# Altium project WT-METER-2CH.PrjPcb (part 1 of 2)
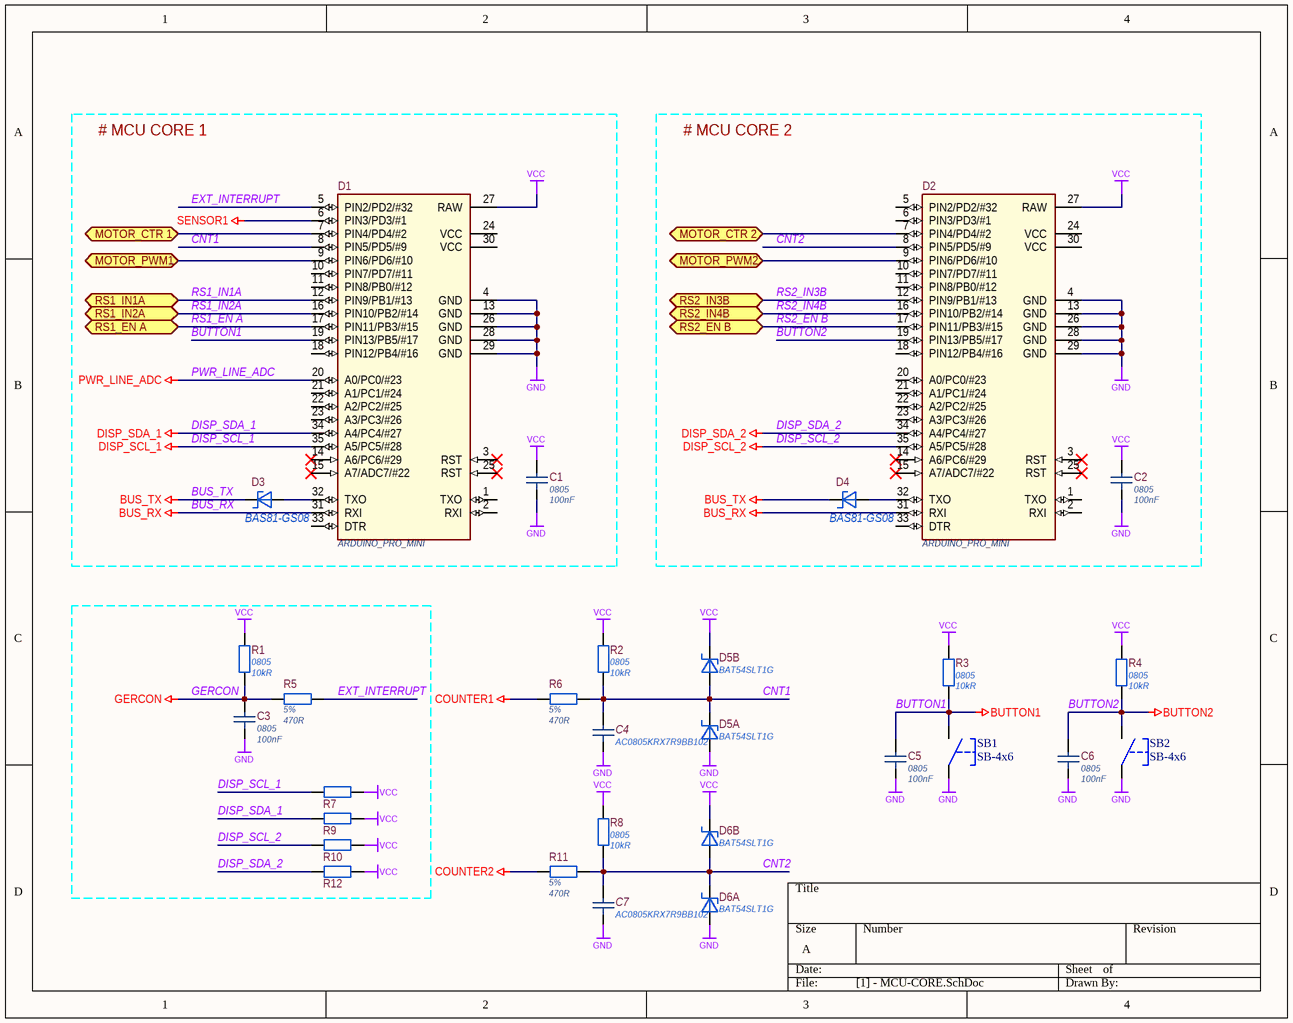
[diagram p0: [1] - MCU-CORE.SchDoc]
7 sheets, 109 parts. Net scope: flat (ports and power ports of the same name join across sheets).
Board file: WT-METER-V0R0B0.PcbDoc
Sheets:
  [1] - MCU-CORE.SchDoc
  [3] - MOTOR-CONTROL.SchDoc
  [4] - MOTOR-DRIVER.SchDoc
  [5] - RS485-TRANSCEIVER.SchDoc
  [6] - POWER.SchDoc
  [7] - CONNECTORS.SchDoc
  [8] - SENSORLESS.SchDoc

## Sheet [1] - MCU-CORE.SchDoc
size A

### Parts
C1  Case/Package: 0805  Capacitance: 100nF  [CH0805C]  (hidden comment: AC0805KRX7R9BB104)
C2  Case/Package: 0805  Capacitance: 100nF  [CH0805C]  (hidden comment: AC0805KRX7R9BB104)
C3  Case/Package: 0805  Capacitance: 100nF  [CH0805C]  (hidden comment: AC0805KRX7R9BB104)
C4  AC0805KRX7R9BB102  [CH0805C]
C5  Case/Package: 0805  Capacitance: 100nF  [CH0805C]  (hidden comment: AC0805KRX7R9BB104)
C6  Case/Package: 0805  Capacitance: 100nF  [CH0805C]  (hidden comment: AC0805KRX7R9BB104)
C7  AC0805KRX7R9BB102  [CH0805C]
D1  ARDUINO_PRO_MINI  [DEV-11114]
D2  ARDUINO_PRO_MINI  [DEV-11114]
D3  BAS81-GS08  [SOD-80]
D4  BAS81-GS08  [SOD-80]
D5  BAT54SLT1G  [SOT23-3]  (parts A,B of 2)
D6  BAT54SLT1G  [SOT23-3]  (parts A,B of 2)
R1  Case/Package: 0805  Resistance: 10kR  [CH0805R]  (hidden comment: RC0805JR-0710KL)
R2  Case/Package: 0805  Resistance: 10kR  [CH0805R]  (hidden comment: RC0805JR-0710KL)
R3  Case/Package: 0805  Resistance: 10kR  [CH0805R]  (hidden comment: RC0805JR-0710KL)
R4  Case/Package: 0805  Resistance: 10kR  [CH0805R]  (hidden comment: RC0805JR-0710KL)
R5  Tolerance: 5%  Resistance: 470R  [CH0805R]  (hidden comment: RC0805JR-07470RL)
R6  Tolerance: 5%  Resistance: 470R  [CH0805R]  (hidden comment: RC0805JR-07470RL)
R7  RC0805JR-074K7L  [CH0805R]  (value not drawn)
R8  Case/Package: 0805  Resistance: 10kR  [CH0805R]  (hidden comment: RC0805JR-0710KL)
R9  RC0805JR-074K7L  [CH0805R]  (value not drawn)
R10  RC0805JR-074K7L  [CH0805R]  (value not drawn)
R11  Tolerance: 5%  Resistance: 470R  [CH0805R]  (hidden comment: RC0805JR-07470RL)
R12  RC0805JR-074K7L  [CH0805R]  (value not drawn)
SB1  SB-4x6  [Button-6*4.5]
SB2  SB-4x6  [Button-6*4.5]

### Blocks framed on the sheet
# MCU CORE 1: C1 D1 D3
# MCU CORE 2: C2 D2 D4

### Ports
MOTOR_CTR 1 (bidir), MOTOR_CTR 2 (bidir), MOTOR_PWM1 (bidir), MOTOR_PWM2 (bidir), RS1_EN A (bidir), RS1_IN1A (bidir), RS1_IN2A (bidir), RS2_EN B (bidir), RS2_IN3B (bidir), RS2_IN4B (bidir)

### Nets
BUS_RX: D1.31(RXI) D2.31(RXI)
BUS_TX: D3.2(K) D4.2(K)
BUTTON1: C5.1 D1.19(PIN13/PB5/#17) R3.1 SB1.2
BUTTON2: C6.1 D2.19(PIN13/PB5/#17) R4.1 SB2.2
COUNTER1: R6.1
COUNTER2: R11.1
DISP_SCL_1: D1.35(A5/PC5/#28) R7.2
DISP_SCL_2: D2.35(A5/PC5/#28) R10.2
DISP_SDA_1: D1.34(A4/PC4/#27) R9.2
DISP_SDA_2: D2.34(A4/PC4/#27) R12.2
GERCON: C3.1 R1.1 R5.1
GND: C1.2 C2.2 C3.2 C4.2 C5.2 C6.2 C7.2 D1.4(GND) D1.13(GND) D1.26(GND) D1.28(GND) D1.29(GND) D2.4(GND) D2.13(GND) D2.26(GND) D2.28(GND) D2.29(GND) D5.1 D6.1 SB1.1 SB2.1
PWR_LINE_ADC: D1.20(A0/PC0/#23)
SENSOR1: D1.6(PIN3/PD3/#1)
VCC: C1.1 C2.1 D1.27(RAW) D2.27(RAW) D5.2 D6.2 R1.2 R2.2 R3.2 R4.2 R7.1 R8.2 R9.1 R10.1 R12.1
CNT1: C4.1 D1.8(PIN5/PD5/#9) D5.3 R2.1 R6.2
CNT2: C7.1 D2.8(PIN5/PD5/#9) D6.3 R8.1 R11.2
EXT_INTERRUPT: D1.5(PIN2/PD2/#32) R5.2
RS1_EN A: D1.17(PIN11/PB3/#15) ; port RS1_EN A
RS1_IN1A: D1.12(PIN9/PB1/#13) ; port RS1_IN1A
RS1_IN2A: D1.16(PIN10/PB2/#14) ; port RS1_IN2A
RS2_EN B: D2.17(PIN11/PB3/#15) ; port RS2_EN B
RS2_IN3B: D2.12(PIN9/PB1/#13) ; port RS2_IN3B
RS2_IN4B: D2.16(PIN10/PB2/#14) ; port RS2_IN4B
NetD1_7: D1.7(PIN4/PD4/#2) ; port MOTOR_CTR 1
NetD1_9: D1.9(PIN6/PD6/#10) ; port MOTOR_PWM1
NetD1_32: D1.32(TXO) D3.1(A)
NetD2_7: D2.7(PIN4/PD4/#2) ; port MOTOR_CTR 2
NetD2_9: D2.9(PIN6/PD6/#10) ; port MOTOR_PWM2
NetD2_32: D2.32(TXO) D4.1(A)

Not connected (* = marked no-connect by the designer): D1 1(TXO) 2(RXI) 3(RST)* 10(PIN7/PD7/#11) 11(PIN8/PB0/#12) 14(A6/PC6/#29)* 15(A7/ADC7/#22)* 18(PIN12/PB4/#16) 21(A1/PC1/#24) 22(A2/PC2/#25) 23(A3/PC3/#26) 24(VCC) 25(RST)* 30(VCC) 33(DTR); D2 1(TXO) 2(RXI) 3(RST)* 5(PIN2/PD2/#32) 6(PIN3/PD3/#1) 10(PIN7/PD7/#11) 11(PIN8/PB0/#12) 14(A6/PC6/#29)* 15(A7/ADC7/#22)* 18(PIN12/PB4/#16) 20(A0/PC0/#23) 21(A1/PC1/#24) 22(A2/PC2/#25) 23(A3/PC3/#26) 24(VCC) 25(RST)* 30(VCC) 33(DTR)

### Library data of the parts
C1-C3 C5 C6 = AC0805KRX7R9BB104: 0.10µF 50V Ceramic Capacitor X7R 0805 (2012 Metric) 0.079" L x 0.049" W (2.00mm x 1.25mm); Manufacturer 1: Yageo; Tolerance: 10%; Supplier 1: Digi-Key; Manufacturer Part Number 1: AC0805KRX7R9BB104; Stock 1: 18765; Pricing 1: 1=0.23000, 10=0.15600, 100=0.07930, 500=0.05424, 1000=0.04799 (USD); RoHS: Yes; Mount: Surface Mount; Min Operating Temperature: -55°C; Max Operating Temperature: 125°C; Packaging: Tape and Reel; Voltage Rating: 50V; Length: 0.079inch; Width: 0.049inch; Thickness: 0.028inch; Ratings: AEC-Q200; Lead Free: Lead Free; ComponentLink1URL: http://www.yageo.com/documents/recent/UPY-AC_NP0X7R_16V-to-630V_12.pdf?src-supplier=Digi-Key; ComponentLink1Description: http://www.yageo.com/documents/recent/UPY-AC_NP0X7R_16V-to-630V_12.pdf?src-supplier=Digi-Key; Supplier Part Number 1: 311-3037-1-ND; Supplier 2: Digi-Key; Supplier Part Number 2: 311-1939-2-ND
C4 C7 = AC0805KRX7R9BB102: CAP CER 1000PF 50V X7R 0805; Manufacturer 1: Yageo; Supplier 1: Digi-Key; Manufacturer Part Number 1: AC0805KRX7R9BB102; Stock 1: 6153; Pricing 1: 1=0.21000, 10=0.14500, 100=0.07340, 500=0.05020, 1000=0.04440 (USD); RoHS: No; Lead Free: Lead Free; Supplier Part Number 1: 311-3173-1-ND
D1 D2 = ARDUINO_PRO_MINI: ATMEGA328 ARDUINO PRO MINI 3.3V; Manufacturer 1: SparkFun; Supplier 1: Digi-Key; Manufacturer Part Number 1: DEV-11114; Stock 1: 569; Pricing 1: 1=9.95000 (USD); RoHS: No; Supplier Part Number 1: 1568-1054-ND
D3 D4 = BAS81-GS08: Diode Small Signal Schottky 40V 0.03A 2-Pin Mini-MELF SOD-80 T/R; Manufacturer 1: Vishay Semiconductors; Max Surge Current: 500mA; Forward Voltage: 1V; Forward Current: 30mA; Peak Reverse Current: 200nA; Element Configuration: Single; Current Rating: 30A; Supplier 1: Digi-Key; Manufacturer Part Number 1: BAS81-GS08; Stock 1: 12175; Pricing 1: 1=0.37000, 10=0.29900, 100=0.15850, 500=0.10428, 1000=0.07092 (USD); RoHS: Yes; Mount: Surface Mount; Number of Pins: 2; Contact Plating: Tin,Silver; Min Operating Temperature: -65°C; Max Operating Temperature: 125°C; Packaging: Tape and Reel; Package Quantity: 2500; Average Rectified Current: 30mA; Max Reverse Leakage Current: 200nA; Peak Non-Repetitive Surge Current: 500mA; Max Repetitive Reverse Voltage (Vrrm): 40V; Max Reverse Voltage (DC): 40V; Max Forward Surge Current (Ifsm): 500mA; Diameter: 1.6mm; Length: 3.7mm; Height: 1.6mm; Width: 1.6mm; Radiation Hardening: No; REACH SVHC: Unknown; ComponentLink1URL: https://datasheet.ciiva.com/1240/1698309-1240528.pdf?src-supplier=Newark; ComponentLink1Description: https://datasheet.ciiva.com/1240/1698309-1240528.pdf?src-supplier=Newark; ComponentLink2URL: https://datasheet.ciiva.com/15144/getdatasheetpartid-45935-15144179.pdf?src-supplier=Verical; ComponentLink2Description: https://datasheet.ciiva.com/15144/getdatasheetpartid-45935-15144179.pdf?src-supplier=Verical; ComponentLink3URL: https://datasheet.ciiva.com/4245/bas81-4245446.pdf?src-supplier=Arrow; ComponentLink3Description: https://datasheet.ciiva.com/4245/bas81-4245446.pdf?src-supplier=Arrow; ComponentLink4URL: https://datasheet.ciiva.com/17076/bas81-gs08-17076266.pdf?src-supplier=Allied+Electronics; ComponentLink4Description: https://datasheet.ciiva.com/17076/bas81-gs08-17076266.pdf?src-supplier=Allied+Electronics; ComponentLink5URL: https://datasheet.ciiva.com/26294/1698309-26294950.pdf?src-supplier=Element14; ComponentLink5Description: https://datasheet.ciiva.com/26294/1698309-26294950.pdf?src-supplier=Element14; ComponentLink6URL: https://datasheet.ciiva.com/16941/70061832-16941562.pdf?src-supplier=Allied+Electronics; ComponentLink6Description: https://datasheet.ciiva.com/16941/70061832-16941562.pdf?src-supplier=Allied+Electronics; Supplier Part Number 1: BAS81-GS08GICT-ND
D5 D6 = BAT54SLT1G: DIODE ARRAY SCHOTTKY 30V SOT23-3; Manufacturer 1: ON Semiconductor; Forward Current: 200mA; Max Surge Current: 600mA; Forward Voltage: 800mV; Peak Reverse Current: 2uA; Recovery Time: 5ns; Element Configuration: Dual; Peak Non-Repetitive Surge Current: 1A; Power Dissipation: 225mW; Capacitance: 10pF; Supplier 1: Digi-Key; Manufacturer Part Number 1: BAT54SLT1G; Stock 1: 1663959; Pricing 1: 1=0,15000, 10=0,13700, 100=0,07440, 500=0,04576, 1000=0,03120 (USD); RoHS: Yes; Case/Package: SOT-23-3; Number of Pins: 3; Contact Plating: Tin,Matte; Min Operating Temperature: -55°C; Max Operating Temperature: 150°C; Packaging: Tape and Reel; Max Repetitive Reverse Voltage (Vrrm): 30V; Package Quantity: 3000; Average Rectified Current: 200mA; Reverse Recovery Time: 5ns; Max Reverse Leakage Current: 2uA; Current Rating: 200mA; Voltage Rating (DC): 30V; Max Reverse Voltage (DC): 30V; Max Forward Surge Current (Ifsm): 600mA; Length: 2.9mm; Height: 0.94mm; Width: 1.3mm; Radiation Hardening: No; Lead Free: Lead Free; Halogen Free: Halogen Free; REACH SVHC: No SVHC; ComponentLink1URL: https://datasheet.ciiva.com/1180/bat54slt1-d-1180304.pdf?src-supplier=Element14; ComponentLink1Description: https://datasheet.ciiva.com/1180/bat54slt1-d-1180304.pdf?src-supplier=Element14; ComponentLink2URL: https://datasheet.ciiva.com/1240/bat54slt1-d-1240837.pdf?src-supplier=Newark; ComponentLink2Description: https://datasheet.ciiva.com/1240/bat54slt1-d-1240837.pdf?src-supplier=Newark; ComponentLink3URL: https://datasheet.ciiva.com/4714/bat54slt1-d-103997-4714086.pdf?src-supplier=Mouser; ComponentLink3Description: https://datasheet.ciiva.com/4714/bat54slt1-d-103997-4714086.pdf?src-supplier=Mouser; ComponentLink4URL: https://datasheet.ciiva.com/1180/bat54slt1-d-1180305.pdf?src-supplier=Element14; ComponentLink4Description: https://datasheet.ciiva.com/1180/bat54slt1-d-1180305.pdf?src-supplier=Element14; ComponentLink5URL: https://datasheet.ciiva.com/14558/70099484-14558437.pdf?src-supplier=Allied+Electronics; ComponentLink5Description: https://datasheet.ciiva.com/14558/70099484-14558437.pdf?src-supplier=Allied+Electronics; ComponentLink6URL: https://datasheet.ciiva.com/905/bat54slt1-d-905830.pdf?src-supplier=Digi-Key; ComponentLink6Description: https://datasheet.ciiva.com/905/bat54slt1-d-905830.pdf?src-supplier=Digi-Key; ComponentLink7URL: https://datasheet.ciiva.com/905/bat54slt1-d-905831.pdf?src-supplier=Digi-Key; ComponentLink7Description: https://datasheet.ciiva.com/905/bat54slt1-d-905831.pdf?src-supplier=Digi-Key; ComponentLink8URL: https://datasheet.ciiva.com/905/bat54slt1-d-905832.pdf?src-supplier=Digi-Key; ComponentLink8Description: https://datasheet.ciiva.com/905/bat54slt1-d-905832.pdf?src-supplier=Digi-Key; ComponentLink9URL: https://datasheet.ciiva.com/8299/bat54slt1-d-8299982.pdf?src-supplier=Avnet; ComponentLink9Description: https://datasheet.ciiva.com/8299/bat54slt1-d-8299982.pdf?src-supplier=Avnet; Supplier Part Number 1: BAT54SLT1GOSCT-ND
R1-R4 R8 = RC0805JR-0710KL: RES SMD 10K OHM 5% 1/8W 0805; Manufacturer 1: Yageo; Power Rating: 125mW; Temperature Coefficient: 100ppm/°C; Voltage Rating: 150V; Supplier 1: Digi-Key; Manufacturer Part Number 1: RC0805JR-0710KL; Pricing 1: 1=0.10000, 10=0.03600, 100=0.01460, 1000=0.00654, 2500=0.00568 (USD); Contact Plating: Tin,Matte; Case Code (Imperial): 0805; Case Code (Metric): 2012; Min Operating Temperature: -55°C; Max Operating Temperature: 155°C; Composition: Thick Film; Tolerance: 5%; Packaging: Tape and Reel; Termination: SMD/SMT; Military Standard: Not; Length: 2mm; Height: 0.5mm; Width: 1.25mm; Depth: 1.25mm; Radiation Hardening: No; REACH SVHC: Unknown; Lead Free: Lead Free; ComponentLink1URL: https://datasheet.ciiva.com/7983/444164-7983765.pdf?src-supplier=Element14; ComponentLink1Description: https://datasheet.ciiva.com/7983/444164-7983765.pdf?src-supplier=Element14; ComponentLink2URL: https://datasheet.ciiva.com/7941/444164-7941870.pdf?src-supplier=Element14; ComponentLink2Description: https://datasheet.ciiva.com/7941/444164-7941870.pdf?src-supplier=Element14; ComponentLink3URL: https://datasheet.ciiva.com/7941/444164-7941871.pdf?src-supplier=Element14; ComponentLink3Description: https://datasheet.ciiva.com/7941/444164-7941871.pdf?src-supplier=Element14; Supplier Part Number 1: 311-10KARCT-ND; Stock 1: 13413905; RoHS: Yes
R5 R6 R11 = RC0805JR-07470RL: RES SMD 470 OHM 5% 1/8W 0805; Manufacturer 1: Yageo; Power Rating: 125mW; Temperature Coefficient: 100ppm/°C; Voltage Rating: 150V; Supplier 1: Digi-Key; Manufacturer Part Number 1: RC0805JR-07470RL; Stock 1: 1884733; Pricing 1: 1=0.10000, 10=0.03600, 100=0.01460, 1000=0.00654, 2500=0.00568 (USD); RoHS: Yes; Case/Package: 0805; Contact Plating: Tin,Matte,Lead; Case Code (Imperial): 0805; Case Code (Metric): 2012; Min Operating Temperature: -55°C; Max Operating Temperature: 155°C; Packaging: Tape and Reel; Composition: Thick Film; Termination: SMD/SMT; Military Standard: Not; Length: 2mm; Depth: 1.25mm; Radiation Hardening: No; REACH SVHC: Unknown; Lead Free: Lead Free; ComponentLink1URL: https://datasheet.ciiva.com/2456/rc080520pb20free-2456048.pdf?src-supplier=Digi-Key; ComponentLink1Description: https://datasheet.ciiva.com/2456/rc080520pb20free-2456048.pdf?src-supplier=Digi-Key; ComponentLink2URL: https://datasheet.ciiva.com/15190/getdatasheetpartid-330937-15190054.pdf?src-supplier=Verical; ComponentLink2Description: https://datasheet.ciiva.com/15190/getdatasheetpartid-330937-15190054.pdf?src-supplier=Verical; ComponentLink3URL: https://datasheet.ciiva.com/12667/rc0805-12667416.pdf?src-supplier=Mouser; ComponentLink3Description: https://datasheet.ciiva.com/12667/rc0805-12667416.pdf?src-supplier=Mouser; ComponentLink4URL: https://datasheet.ciiva.com/16740/rc0805-16740745.pdf?src-supplier=Future+Electronics; ComponentLink4Description: https://datasheet.ciiva.com/16740/rc0805-16740745.pdf?src-supplier=Future+Electronics; ComponentLink5URL: https://datasheet.ciiva.com/7941/442941-7941965.pdf?src-supplier=Element14; ComponentLink5Description: https://datasheet.ciiva.com/7941/442941-7941965.pdf?src-supplier=Element14; ComponentLink6URL: https://datasheet.ciiva.com/7941/442941-7941966.pdf?src-supplier=Element14; ComponentLink6Description: https://datasheet.ciiva.com/7941/442941-7941966.pdf?src-supplier=Element14; ComponentLink7URL: https://datasheet.ciiva.com/46395/444164-46395134.pdf?src-supplier=Element14; ComponentLink7Description: https://datasheet.ciiva.com/46395/444164-46395134.pdf?src-supplier=Element14; Supplier Part Number 1: 311-470ARCT-ND
R7 R9 R10 R12 = RC0805JR-074K7L: RES SMD 4.7K OHM 5% 1/8W 0805; Manufacturer 1: Yageo; Resistance: 4.7kR; Temperature Coefficient: 100ppm/°C; Power Rating: 125mW; Voltage Rating: 150V; Supplier 1: Digi-Key; Manufacturer Part Number 1: RC0805JR-074K7L; Stock 1: 3389846; Pricing 1: 1=0.10000, 10=0.03600, 100=0.01460, 1000=0.00654, 2500=0.00568 (USD); RoHS: Yes; Case/Package: Molded; Contact Plating: Tin,Lead,Matte; Case Code (Imperial): 0805; Case Code (Metric): 2012; Min Operating Temperature: -55°C; Max Operating Temperature: 155°C; Tolerance: 5%; Composition: Thick Film; Packaging: Tape and Reel; Termination: SMD/SMT; Military Standard: Not; Length: 2mm; Depth: 1.25mm; Radiation Hardening: No; REACH SVHC: Unknown; Lead Free: Lead Free; ComponentLink1URL: https://datasheet.ciiva.com/7941/442941-7941974.pdf?src-supplier=Element14; ComponentLink1Description: https://datasheet.ciiva.com/7941/442941-7941974.pdf?src-supplier=Element14; ComponentLink2URL: https://datasheet.ciiva.com/7941/442941-7941973.pdf?src-supplier=Element14; ComponentLink2Description: https://datasheet.ciiva.com/7941/442941-7941973.pdf?src-supplier=Element14; ComponentLink3URL: https://datasheet.ciiva.com/17486/rc0805-17486827.pdf?src-supplier=Future+Electronics; ComponentLink3Description: https://datasheet.ciiva.com/17486/rc0805-17486827.pdf?src-supplier=Future+Electronics; ComponentLink4URL: https://datasheet.ciiva.com/12667/rc0805-12667037.pdf?src-supplier=Mouser; ComponentLink4Description: https://datasheet.ciiva.com/12667/rc0805-12667037.pdf?src-supplier=Mouser; Supplier Part Number 1: 311-4.7KARCT-ND

## Sheet [3] - MOTOR-CONTROL.SchDoc
size A
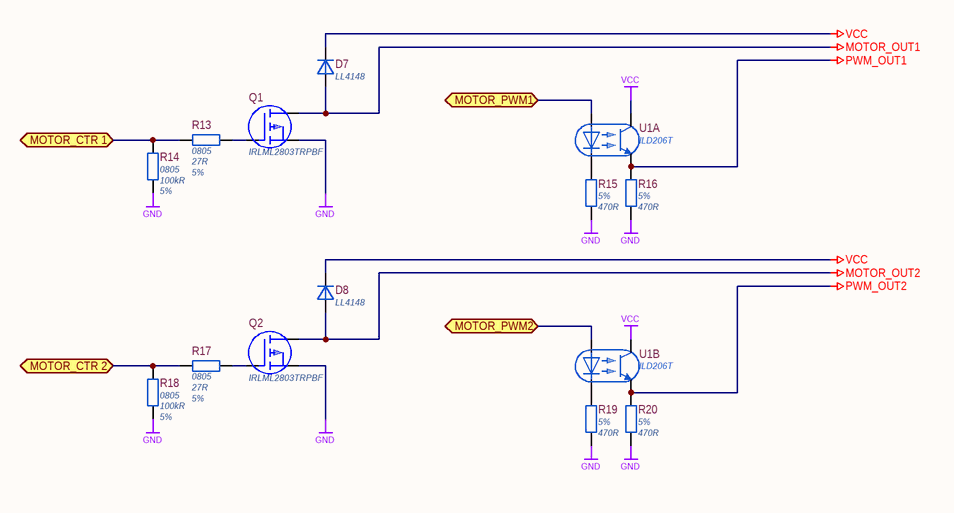
[diagram p1: [3] - MOTOR-CONTROL.SchDoc]

### Parts
D7  LL4148  [SOD-89]
D8  LL4148  [SOD-89]
Q1  IRLML2803TRPBF  [SOT23-3]
Q2  IRLML2803TRPBF  [SOT23-3]
R13  Case Code (Imperial): 0805  Resistance: 27R  Tolerance: 5%  [CH0805R]  (hidden comment: RC0805JR-0727RL)
R14  Case Code (Imperial): 0805  Resistance: 100kR  Tolerance: 5%  [CH0805R]  (hidden comment: RC0805JR-07100KL)
R15  Tolerance: 5%  Resistance: 470R  [CH0805R]  (hidden comment: RC0805JR-07470RL)
R16  Tolerance: 5%  Resistance: 470R  [CH0805R]  (hidden comment: RC0805JR-07470RL)
R17  Case Code (Imperial): 0805  Resistance: 27R  Tolerance: 5%  [CH0805R]  (hidden comment: RC0805JR-0727RL)
R18  Case Code (Imperial): 0805  Resistance: 100kR  Tolerance: 5%  [CH0805R]  (hidden comment: RC0805JR-07100KL)
R19  Tolerance: 5%  Resistance: 470R  [CH0805R]  (hidden comment: RC0805JR-07470RL)
R20  Tolerance: 5%  Resistance: 470R  [CH0805R]  (hidden comment: RC0805JR-07470RL)
U1  ILD206T  [SOIC-8]  (parts A,B of 2)

### Ports
MOTOR_CTR 1 (bidir), MOTOR_CTR 2 (bidir), MOTOR_PWM1 (bidir), MOTOR_PWM2 (bidir)

### Nets
GND: Q1.2(S) Q2.2(S) R14.1 R15.1 R16.1 R18.1 R19.1 R20.1
MOTOR_OUT1: D7.1(A) Q1.3(D)
MOTOR_OUT2: D8.1(A) Q2.3(D)
PWM_OUT1: R16.2 U1.7(E1)
PWM_OUT2: R20.2 U1.5(E2)
VCC: D7.2(K) D8.2(K) U1.6(C2) U1.8(C1)
NetD1_7: R13.1 R14.2 ; port MOTOR_CTR 1
NetD1_9: U1.1(A1) ; port MOTOR_PWM1
NetD2_7: R17.1 R18.2 ; port MOTOR_CTR 2
NetD2_9: U1.3(A2) ; port MOTOR_PWM2
NetQ1_1: Q1.1(G) R13.2
NetQ2_1: Q2.1(G) R17.2
NetR15_2: R15.2 U1.2(K1)
NetR19_2: R19.2 U1.4(K2)

### Library data of the parts
D7 D8 = LL4148: ON SEMICONDUCTOR - LL4148 - DIODE, SMALL SIGNAL, 100V, MINIMELF; Manufacturer 1: ON Semiconductor / Fairchild; Element Configuration: Single; Forward Voltage: 1V; Forward Current: 200mA; Reverse Recovery Time: 4ns; Peak Non-Repetitive Surge Current: 2A; Peak Reverse Current: 25nA; Power Dissipation: 500mW; Supplier 1: Digi-Key; Manufacturer Part Number 1: LL4148; Stock 1: 905673; Pricing 1: 1=0.10000, 10=0.09100, 100=0.04930, 500=0.03036, 1000=0.02070 (USD); RoHS: Yes; Mount: Surface Mount; Number of Pins: 2; Weight: 0.01lb; Contact Plating: Tin; Min Operating Temperature: -65°C; Max Operating Temperature: 175°C; Packaging: Tape and Reel; Max Repetitive Reverse Voltage (Vrrm): 100V; Max Reverse Voltage (DC): 100V; Average Rectified Current: 200mA; Package Quantity: 2500; Max Forward Surge Current (Ifsm): 2A; Max Surge Current: 2A; Recovery Time: 4ns; Voltage: 100V; Reverse Voltage: 100V; Length: 3.6mm; Height: 1.5mm; Width: 1.5mm; Radiation Hardening: No; Lead Free: Lead Free; REACH SVHC: No SVHC; ComponentLink1URL: https://datasheet.ciiva.com/1181/1730036-1181026.pdf?src-supplier=Element14; ComponentLink1Description: https://datasheet.ciiva.com/1181/1730036-1181026.pdf?src-supplier=Element14; ComponentLink2URL: https://datasheet.ciiva.com/8303/ll4148-8303779.pdf?src-supplier=Avnet; ComponentLink2Description: https://datasheet.ciiva.com/8303/ll4148-8303779.pdf?src-supplier=Avnet; ComponentLink3URL: https://datasheet.ciiva.com/27048/94908-27048041.pdf?src-supplier=Jameco; ComponentLink3Description: https://datasheet.ciiva.com/27048/94908-27048041.pdf?src-supplier=Jameco; ComponentLink4URL: https://datasheet.ciiva.com/4453/ll4148-70504-4453114.pdf?src-supplier=Mouser; ComponentLink4Description: https://datasheet.ciiva.com/4453/ll4148-70504-4453114.pdf?src-supplier=Mouser; ComponentLink5URL: https://datasheet.ciiva.com/910/ll4148-910344.pdf?src-supplier=Digi-Key; ComponentLink5Description: https://datasheet.ciiva.com/910/ll4148-910344.pdf?src-supplier=Digi-Key; ComponentLink6URL: https://datasheet.ciiva.com/8053/1896420-8053645.pdf?src-supplier=Element14; ComponentLink6Description: https://datasheet.ciiva.com/8053/1896420-8053645.pdf?src-supplier=Element14; ComponentLink7URL: https://datasheet.ciiva.com/910/ll4148-910343.pdf?src-supplier=Digi-Key; ComponentLink7Description: https://datasheet.ciiva.com/910/ll4148-910343.pdf?src-supplier=Digi-Key; ComponentLink8URL: https://datasheet.ciiva.com/910/ll4148-910345.pdf?src-supplier=Digi-Key; ComponentLink8Description: https://datasheet.ciiva.com/910/ll4148-910345.pdf?src-supplier=Digi-Key; ComponentLink9URL: https://datasheet.ciiva.com/22735/1896420-22735578.pdf?src-supplier=Element14; ComponentLink9Description: https://datasheet.ciiva.com/22735/1896420-22735578.pdf?src-supplier=Element14; ComponentLink10URL: https://datasheet.ciiva.com/26912/getdatasheetpartid-110057-26912779.pdf?src-supplier=Verical; ComponentLink10Description: https://datasheet.ciiva.com/26912/getdatasheetpartid-110057-26912779.pdf?src-supplier=Verical; Supplier Part Number 1: LL4148FSCT-ND
Q1 Q2 = IRLML2803TRPBF: Trans MOSFET N-CH 30V 1.2A 3-Pin SOT-23 T/R; Manufacturer 1: International Rectifier; Gate to Source Voltage (Vgs): 20V; Power Dissipation: 540mW; Turn-On Delay Time: 3.9ns; Turn-Off Delay Time: 9ns; Rise Time: 4ns; Rds On Max: 250mR; Input Capacitance: 85pF; Fall Time: 1.7ns; Number of Elements: 1; Nominal Vgs: 1V; Drain to Source Resistance: 400mR; Element Configuration: Single; Supplier 1: Digi-Key; Manufacturer Part Number 1: IRLML2803TRPBF; Stock 1: 39860; Pricing 1: 1=0.38000, 10=0.30900, 100=0.21030, 500=0.15770, 1000=0.11828 (USD); RoHS: Yes; Mount: Surface Mount; Case/Package: SOT-23; Number of Pins: 3; Min Operating Temperature: -55°C; Max Operating Temperature: 150°C; Continuous Drain Current (ID): 1.2A; Packaging: Tape and Reel; Drain to Source Voltage (Vdss): 30V; Max Power Dissipation: 540mW; Package Quantity: 1; Dual Supply Voltage: 30V; Drain to Source Breakdown Voltage: 30V; On-State Resistance: 250mR; Min Breakdown Voltage: 30V; Termination: SMD/SMT; Threshold Voltage: 1V; Voltage Rating (DC): 30V; Current Rating: 1.2A; Length: 3.04mm; Height: 1.02mm; Width: 1.4mm; Radiation Hardening: No; REACH SVHC: No SVHC; Lead Free: Lead Free; ComponentLink1URL: https://datasheet.ciiva.com/27092/1563665-27092836.pdf?src-supplier=Jameco; ComponentLink1Description: https://datasheet.ciiva.com/27092/1563665-27092836.pdf?src-supplier=Jameco; ComponentLink2URL: https://datasheet.ciiva.com/29326/162828-da-01-en-irlml-2803tr-29326785.pdf?src-supplier=Conrad; ComponentLink2Description: https://datasheet.ciiva.com/29326/162828-da-01-en-irlml-2803tr-29326785.pdf?src-supplier=Conrad; ComponentLink3URL: https://datasheet.ciiva.com/16371/irlml2803pbf-16371749.pdf?src-supplier=Future+Electronics; ComponentLink3Description: https://datasheet.ciiva.com/16371/irlml2803pbf-16371749.pdf?src-supplier=Future+Electronics; ComponentLink4URL: https://datasheet.ciiva.com/6383/irlml2803pbf-6383355.pdf?src-supplier=Digi-Key; ComponentLink4Description: https://datasheet.ciiva.com/6383/irlml2803pbf-6383355.pdf?src-supplier=Digi-Key; ComponentLink5URL: https://datasheet.ciiva.com/5950/irlml2803pbf-5950573.pdf?src-supplier=Farnell; ComponentLink5Description: https://datasheet.ciiva.com/5950/irlml2803pbf-5950573.pdf?src-supplier=Farnell; ComponentLink6URL: https://datasheet.ciiva.com/6383/irlml2803pbf-6383357.pdf?src-supplier=Digi-Key; ComponentLink6Description: https://datasheet.ciiva.com/6383/irlml2803pbf-6383357.pdf?src-supplier=Digi-Key; ComponentLink7URL: https://datasheet.ciiva.com/6383/irlml2803pbf-6383354.pdf?src-supplier=Digi-Key; ComponentLink7Description: https://datasheet.ciiva.com/6383/irlml2803pbf-6383354.pdf?src-supplier=Digi-Key; Supplier Part Number 1: IRLML2803PBFCT-ND
R13 R17 = RC0805JR-0727RL: RES SMD 27 OHM 5% 1/8W 0805; Manufacturer 1: Yageo; Temperature Coefficient: 100ppm/°C; Power Rating: 125mW; Voltage Rating: 150V; Supplier 1: Digi-Key; Manufacturer Part Number 1: RC0805JR-0727RL; Stock 1: 268144; Pricing 1: 1=0.10000, 10=0.03600, 100=0.01460, 1000=0.00654, 2500=0.00568 (USD); RoHS: Yes; Case/Package: 0805; Weight: 0.000194oz; Contact Plating: Tin,Matte,Lead; Case Code (Metric): 2012; Min Operating Temperature: -55°C; Max Operating Temperature: 155°C; Composition: Thick Film; Package Quantity: 1; Packaging: Tape and Reel; Number of Terminations: 2; Termination: SMD/SMT; Military Standard: Not; Max Power Dissipation: 125mW; Features: Moisture Resistant; Length: 2mm; Height: 0.024inch; Width: 0.049inch; Depth: 1.25mm; Radiation Hardening: No; REACH SVHC: Unknown; Lead Free: Lead Free; ComponentLink1URL: https://datasheet.ciiva.com/2456/pyu-r-int-thick-7-2456049.pdf?src-supplier=Digi-Key; ComponentLink1Description: https://datasheet.ciiva.com/2456/pyu-r-int-thick-7-2456049.pdf?src-supplier=Digi-Key; ComponentLink2URL: https://datasheet.ciiva.com/2456/pyu-r-int-thick-7-2456050.pdf?src-supplier=Digi-Key; ComponentLink2Description: https://datasheet.ciiva.com/2456/pyu-r-int-thick-7-2456050.pdf?src-supplier=Digi-Key; ComponentLink3URL: https://datasheet.ciiva.com/2456/pyu-r-int-thick-7-2456051.pdf?src-supplier=Digi-Key; ComponentLink3Description: https://datasheet.ciiva.com/2456/pyu-r-int-thick-7-2456051.pdf?src-supplier=Digi-Key; ComponentLink4URL: https://datasheet.ciiva.com/17050/rc0805-17050396.pdf?src-supplier=Future+Electronics; ComponentLink4Description: https://datasheet.ciiva.com/17050/rc0805-17050396.pdf?src-supplier=Future+Electronics; ComponentLink5URL: https://datasheet.ciiva.com/7941/442941-7941933.pdf?src-supplier=Element14; ComponentLink5Description: https://datasheet.ciiva.com/7941/442941-7941933.pdf?src-supplier=Element14; ComponentLink6URL: https://datasheet.ciiva.com/12577/rc0805-12577759.pdf?src-supplier=Mouser; ComponentLink6Description: https://datasheet.ciiva.com/12577/rc0805-12577759.pdf?src-supplier=Mouser; ComponentLink7URL: https://datasheet.ciiva.com/7941/442941-7941934.pdf?src-supplier=Element14; ComponentLink7Description: https://datasheet.ciiva.com/7941/442941-7941934.pdf?src-supplier=Element14; Supplier Part Number 1: 311-27ARCT-ND
R14 R18 = RC0805JR-07100KL: RES SMD 100K OHM 5% 1/8W 0805; Manufacturer 1: Yageo; Temperature Coefficient: 100ppm/°C; Power Rating: 125mW; Voltage Rating: 150V; Supplier 1: Digi-Key; Manufacturer Part Number 1: RC0805JR-07100KL; Stock 1: 4415203; Pricing 1: 1=0.10000, 10=0.03600, 100=0.01460, 1000=0.00654, 2500=0.00568 (USD); RoHS: Yes; Case/Package: 0805; Contact Plating: Tin,Matte,Lead; Case Code (Metric): 2012; Min Operating Temperature: -55°C; Max Operating Temperature: 155°C; Composition: Thick Film; Packaging: Tape and Reel; Termination: SMD/SMT; Military Standard: Not; Length: 2mm; Depth: 1.25mm; Radiation Hardening: No; REACH SVHC: Unknown; Lead Free: Lead Free; ComponentLink1URL: https://datasheet.ciiva.com/7941/442941-7941864.pdf?src-supplier=Element14; ComponentLink1Description: https://datasheet.ciiva.com/7941/442941-7941864.pdf?src-supplier=Element14; ComponentLink2URL: https://datasheet.ciiva.com/7941/442941-7941865.pdf?src-supplier=Element14; ComponentLink2Description: https://datasheet.ciiva.com/7941/442941-7941865.pdf?src-supplier=Element14; ComponentLink3URL: https://datasheet.ciiva.com/15190/getdatasheetpartid-479267-15190029.pdf?src-supplier=Verical; ComponentLink3Description: https://datasheet.ciiva.com/15190/getdatasheetpartid-479267-15190029.pdf?src-supplier=Verical; Supplier Part Number 1: 311-100KARCT-ND
R15 R16 R19 R20 = RC0805JR-07470RL: as R5 on sheet [1] - MCU-CORE; Supplier 1: Digi-Key; Manufacturer Part Number 1: RC0805JR-07470RL; Stock 1: 1884733; Pricing 1: 1=0.10000, 10=0.03600, 100=0.01460, 1000=0.00654, 2500=0.00568 (USD); RoHS: Yes; Case/Package: 0805; Contact Plating: Tin,Matte,Lead; Case Code (Imperial): 0805; Case Code (Metric): 2012; Min Operating Temperature: -55°C; Max Operating Temperature: 155°C; Packaging: Tape and Reel; Composition: Thick Film; Termination: SMD/SMT; Military Standard: Not; Length: 2mm; Depth: 1.25mm; Radiation Hardening: No; REACH SVHC: Unknown; Lead Free: Lead Free; ComponentLink1URL: https://datasheet.ciiva.com/2456/rc080520pb20free-2456048.pdf?src-supplier=Digi-Key; ComponentLink1Description: https://datasheet.ciiva.com/2456/rc080520pb20free-2456048.pdf?src-supplier=Digi-Key; ComponentLink2URL: https://datasheet.ciiva.com/15190/getdatasheetpartid-330937-15190054.pdf?src-supplier=Verical; ComponentLink2Description: https://datasheet.ciiva.com/15190/getdatasheetpartid-330937-15190054.pdf?src-supplier=Verical; ComponentLink3URL: https://datasheet.ciiva.com/12667/rc0805-12667416.pdf?src-supplier=Mouser; ComponentLink3Description: https://datasheet.ciiva.com/12667/rc0805-12667416.pdf?src-supplier=Mouser; ComponentLink4URL: https://datasheet.ciiva.com/16740/rc0805-16740745.pdf?src-supplier=Future+Electronics; ComponentLink4Description: https://datasheet.ciiva.com/16740/rc0805-16740745.pdf?src-supplier=Future+Electronics; ComponentLink5URL: https://datasheet.ciiva.com/7941/442941-7941965.pdf?src-supplier=Element14; ComponentLink5Description: https://datasheet.ciiva.com/7941/442941-7941965.pdf?src-supplier=Element14; ComponentLink6URL: https://datasheet.ciiva.com/7941/442941-7941966.pdf?src-supplier=Element14; ComponentLink6Description: https://datasheet.ciiva.com/7941/442941-7941966.pdf?src-supplier=Element14; ComponentLink7URL: https://datasheet.ciiva.com/46395/444164-46395134.pdf?src-supplier=Element14; ComponentLink7Description: https://datasheet.ciiva.com/46395/444164-46395134.pdf?src-supplier=Element14; Supplier Part Number 1: 311-470ARCT-ND
U1 = ILD206T: OPTOISOLTR 4KV 2CH TRANS 8-SOIC; Manufacturer 1: Vishay Semiconductors; Max Power Dissipation: 300mW; Forward Current: 30mA; Number of Channels: 2; Collector Emitter Voltage (VCEO): 70V; Reverse Breakdown Voltage: 6V; Forward Voltage: 1.55V; Collector Emitter Saturation Voltage: 400mV; Rise Time: 3us; Fall Time: 4.7us; Current Transfer Ratio: 125%; Input Current: 10mA; Voltage Rating (DC): 5V; Approvals: UL; Supplier 1: Digi-Key; Manufacturer Part Number 1: ILD206T; Stock 1: 1775; Pricing 1: 1=1.42000, 10=1.15000, 100=0.70770, 500=0.60154, 1000=0.49539 (USD); RoHS: Yes; Mount: Surface Mount; Case/Package: SOIC; Number of Pins: 8; Contact Plating: Tin; Min Operating Temperature: -55°C; Max Operating Temperature: 100°C; Packaging: Tape and Reel; Package Quantity: 1; Output Voltage: 70V; Max Output Voltage: 70V; Isolation Voltage: 4kV; Max Input Current: 30mA; Number of Elements: 2; Power Dissipation: 300mW; Collector Emitter Breakdown Voltage: 70V; Radiation Hardening: No; REACH SVHC: Unknown; Lead Free: Lead Free; ComponentLink1URL: https://datasheet.ciiva.com/8040/6546-8040800.pdf?src-supplier=Element14; ComponentLink1Description: https://datasheet.ciiva.com/8040/6546-8040800.pdf?src-supplier=Element14; ComponentLink2URL: https://datasheet.ciiva.com/15118/getdatasheetpartid-90557-15118533.pdf?src-supplier=Verical; ComponentLink2Description: https://datasheet.ciiva.com/15118/getdatasheetpartid-90557-15118533.pdf?src-supplier=Verical; ComponentLink3URL: https://datasheet.ciiva.com/11771/0900766b80800ea7-11771944.pdf?src-supplier=RSComponents; ComponentLink3Description: https://datasheet.ciiva.com/11771/0900766b80800ea7-11771944.pdf?src-supplier=RSComponents; ComponentLink4URL: https://datasheet.ciiva.com/14169/wr630131-630134-e-14169304.pdf?src-supplier=Distrelec; ComponentLink4Description: https://datasheet.ciiva.com/14169/wr630131-630134-e-14169304.pdf?src-supplier=Distrelec; ComponentLink5URL: https://datasheet.ciiva.com/29301/153399-da-01-en-optokoppler-ild206-t-soic8-vis-29301383.pdf?src-supplier=Conrad; ComponentLink5Description: https://datasheet.ciiva.com/29301/153399-da-01-en-optokoppler-ild206-t-soic8-vis-29301383.pdf?src-supplier=Conrad; ComponentLink6URL: https://datasheet.ciiva.com/18445/70061477-18445110.pdf?src-supplier=Allied+Electronics; ComponentLink6Description: https://datasheet.ciiva.com/18445/70061477-18445110.pdf?src-supplier=Allied+Electronics; ComponentLink7URL: https://datasheet.ciiva.com/12242/ild205t-244792-12242999.pdf?src-supplier=Mouser; ComponentLink7Description: https://datasheet.ciiva.com/12242/ild205t-244792-12242999.pdf?src-supplier=Mouser; ComponentLink8URL: https://datasheet.ciiva.com/2086/ild205t-2086025.pdf?src-supplier=Digi-Key; ComponentLink8Description: https://datasheet.ciiva.com/2086/ild205t-2086025.pdf?src-supplier=Digi-Key; ComponentLink9URL: https://datasheet.ciiva.com/2086/ild205t-2086026.pdf?src-supplier=Digi-Key; ComponentLink9Description: https://datasheet.ciiva.com/2086/ild205t-2086026.pdf?src-supplier=Digi-Key; ComponentLink10URL: https://datasheet.ciiva.com/2086/ild205t-2086027.pdf?src-supplier=Digi-Key; ComponentLink10Description: https://datasheet.ciiva.com/2086/ild205t-2086027.pdf?src-supplier=Digi-Key; ComponentLink11URL: https://datasheet.ciiva.com/3305/ild205t-3305918.pdf?src-supplier=Avnet; ComponentLink11Description: https://datasheet.ciiva.com/3305/ild205t-3305918.pdf?src-supplier=Avnet; ComponentLink12URL: https://datasheet.ciiva.com/26321/485037-26321070.pdf?src-supplier=Element14; ComponentLink12Description: https://datasheet.ciiva.com/26321/485037-26321070.pdf?src-supplier=Element14; Supplier Part Number 1: 751-1309-1-ND

## Sheet [4] - MOTOR-DRIVER.SchDoc
size A
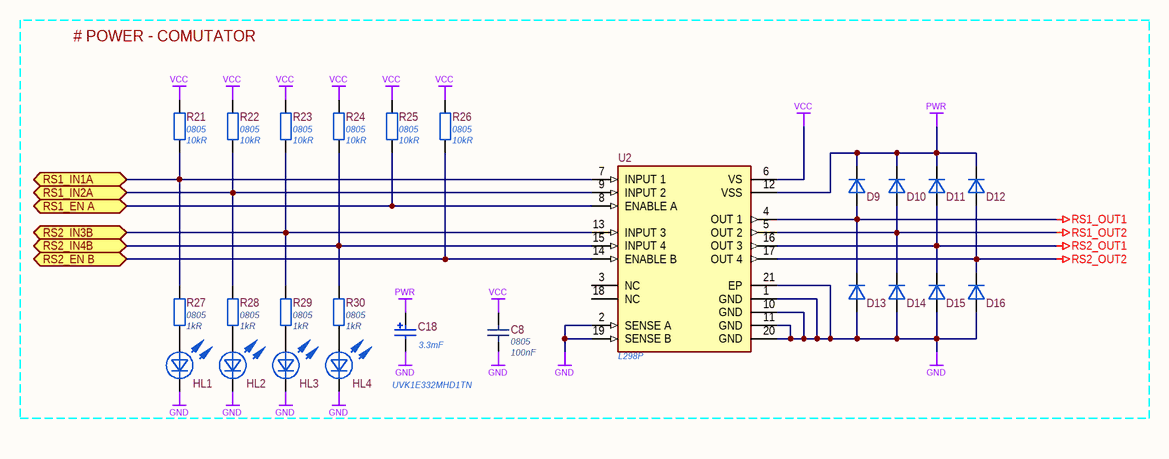
[diagram p2: [4] - MOTOR-DRIVER.SchDoc]

### Parts
C8  Case/Package: 0805  Capacitance: 100nF  [CH0805C]  (hidden comment: AC0805KRX7R9BB104)
C18  UVK1E332MHD1TN  Capacitance: 3.3mF  [El-d16-h26-F7.62]
D9  RS1MB-13-F  [SMB]  (value not drawn)
D10  RS1MB-13-F  [SMB]  (value not drawn)
D11  RS1MB-13-F  [SMB]  (value not drawn)
D12  RS1MB-13-F  [SMB]  (value not drawn)
D13  RS1MB-13-F  [SMB]  (value not drawn)
D14  RS1MB-13-F  [SMB]  (value not drawn)
D15  RS1MB-13-F  [SMB]  (value not drawn)
D16  RS1MB-13-F  [SMB]  (value not drawn)
HL1  SMLLXT0805GWTR  [CH0805LG]  (value not drawn)
HL2  SMLLXT0805GWTR  [CH0805LG]  (value not drawn)
HL3  SMLLXT0805GWTR  [CH0805LG]  (value not drawn)
HL4  SMLLXT0805GWTR  [CH0805LG]  (value not drawn)
R21  Case Code (Imperial): 0805  Resistance: 10kR  [CH0805R]  (hidden comment: RC0805JR-0710KL)
R22  Case Code (Imperial): 0805  Resistance: 10kR  [CH0805R]  (hidden comment: RC0805JR-0710KL)
R23  Case Code (Imperial): 0805  Resistance: 10kR  [CH0805R]  (hidden comment: RC0805JR-0710KL)
R24  Case Code (Imperial): 0805  Resistance: 10kR  [CH0805R]  (hidden comment: RC0805JR-0710KL)
R25  Case Code (Imperial): 0805  Resistance: 10kR  [CH0805R]  (hidden comment: RC0805JR-0710KL)
R26  Case Code (Imperial): 0805  Resistance: 10kR  [CH0805R]  (hidden comment: RC0805JR-0710KL)
R27  Case Code (Imperial): 0805  Resistance: 1kR  [CH0805R]  (hidden comment: RC0805JR-071KL)
R28  Case Code (Imperial): 0805  Resistance: 1kR  [CH0805R]  (hidden comment: RC0805JR-071KL)
R29  Case Code (Imperial): 0805  Resistance: 1kR  [CH0805R]  (hidden comment: RC0805JR-071KL)
R30  Case Code (Imperial): 0805  Resistance: 1kR  [CH0805R]  (hidden comment: RC0805JR-071KL)
U2  L298P  [STM-PowerSO20_N]

### Blocks framed on the sheet
# POWER - COMUTATOR: C8 C18 D9-D16 HL1-HL4 R21-R30 U2

### Ports
RS1_EN A (bidir), RS1_IN1A (bidir), RS1_IN2A (bidir), RS2_EN B (bidir), RS2_IN3B (bidir), RS2_IN4B (bidir)

### Nets
GND: C8.2 C18.2 D13.1(A) D14.1(A) D15.1(A) D16.1(A) HL1.2(K) HL2.2(K) HL3.2(K) HL4.2(K) U2.1(GND) U2.2(SENSE_A) U2.10(GND) U2.11(GND) U2.19(SENSE_B) U2.20(GND) U2.21(EP)
PWR: C18.1 D9.2(K) D10.2(K) D11.2(K) D12.2(K) U2.12(VSS)
RS1_OUT1: D9.1(A) D13.2(K) U2.4(OUT_1)
RS1_OUT2: D10.1(A) D14.2(K) U2.5(OUT_2)
RS2_OUT1: D11.1(A) D15.2(K) U2.16(OUT_3)
RS2_OUT2: D12.1(A) D16.2(K) U2.17(OUT_4)
VCC: C8.1 R21.2 R22.2 R23.2 R24.2 R25.2 R26.2 U2.6(VS)
RS1_EN A: R25.1 U2.8(ENABLE_A) ; port RS1_EN A
RS1_IN1A: R21.1 R27.2 U2.7(INPUT_1) ; port RS1_IN1A
RS1_IN2A: R22.1 R28.2 U2.9(INPUT_2) ; port RS1_IN2A
RS2_EN B: R26.1 U2.14(ENABLE_B) ; port RS2_EN B
RS2_IN3B: R23.1 R29.2 U2.13(INPUT_3) ; port RS2_IN3B
RS2_IN4B: R24.1 R30.2 U2.15(INPUT_4) ; port RS2_IN4B
NetHL1_1: HL1.1(A) R27.1
NetHL2_1: HL2.1(A) R28.1
NetHL3_1: HL3.1(A) R29.1
NetHL4_1: HL4.1(A) R30.1

Not connected (* = marked no-connect by the designer): U2 3(NC) 18(NC)

### Library data of the parts
C8 = AC0805KRX7R9BB104: as C1 on sheet [1] - MCU-CORE; Supplier 1: Digi-Key; Manufacturer Part Number 1: AC0805KRX7R9BB104; Stock 1: 18765; Pricing 1: 1=0.23000, 10=0.15600, 100=0.07930, 500=0.05424, 1000=0.04799 (USD); RoHS: Yes; Mount: Surface Mount; Min Operating Temperature: -55°C; Max Operating Temperature: 125°C; Packaging: Tape and Reel; Voltage Rating: 50V; Length: 0.079inch; Width: 0.049inch; Thickness: 0.028inch; Ratings: AEC-Q200; Lead Free: Lead Free; ComponentLink1URL: http://www.yageo.com/documents/recent/UPY-AC_NP0X7R_16V-to-630V_12.pdf?src-supplier=Digi-Key; ComponentLink1Description: http://www.yageo.com/documents/recent/UPY-AC_NP0X7R_16V-to-630V_12.pdf?src-supplier=Digi-Key; Supplier Part Number 1: 311-3037-1-ND; Supplier 2: Digi-Key; Supplier Part Number 2: 311-1939-2-ND
C18 = UVK1E332MHD1TN: CAP ALUM 3300UF 20% 25V RADIAL; Manufacturer 1: Nichicon; Ripple Current: 1.98A; Life (Hours): 2000Hour; Supplier 1: Digi-Key; Manufacturer Part Number 1: UVK1E332MHD1TN; Stock 1: 317; Pricing 1: 1=1.13000, 10=0.89600, 100=0.67200 (USD); RoHS: Yes; Mount: Through Hole; Case/Package: Radial; Min Operating Temperature: -40°C; Max Operating Temperature: 85°C; Package Quantity: 1; Packaging: Tape and Reel; Tolerance: 20%; Voltage Rating: 25V; Lead Pitch: 0.295inch; Height - Seated (Max): 1.063inch; ComponentLink1URL: https://datasheet.ciiva.com/29547/e-vk-29547493.pdf?src-supplier=Digi-Key; ComponentLink1Description: https://datasheet.ciiva.com/29547/e-vk-29547493.pdf?src-supplier=Digi-Key; Supplier Part Number 1: 493-12564-1-ND
D9-D16 = RS1MB-13-F: DIODE GEN PURP 1KV 1A SMB; Manufacturer 1: Diodes; Polarity: Standard; Max Surge Current: 30A; Forward Voltage: 1.3V; Element Configuration: Single; Peak Reverse Current: 5uA; Recovery Time: 500ns; Capacitance: 15pF; Supplier 1: Digi-Key; Manufacturer Part Number 1: RS1MB-13-F; Stock 1: 40693; Pricing 1: 1=0.42000, 10=0.33900, 100=0.23070, 500=0.17304, 1000=0.12978 (USD); RoHS: Yes; Mount: Surface Mount; Case/Package: SMB; Number of Pins: 2; Weight: 0.00328oz; Min Operating Temperature: -65°C; Max Operating Temperature: 150°C; Package Quantity: 3000; Packaging: Tape and Reel; Average Rectified Current: 1A; Peak Non-Repetitive Surge Current: 30A; Voltage Rating (DC): 1kV; Current Rating: 1A; Output Current: 1A; Max Reverse Voltage (DC): 1kV; Max Repetitive Reverse Voltage (Vrrm): 1kV; Forward Current: 1A; Reverse Recovery Time: 500ns; Reverse Voltage (DC): 1kV; Length: 4.57mm; Height: 2.42mm; Width: 3.94mm; Radiation Hardening: No; Lead Free: Lead Free; ComponentLink1URL: https://datasheet.ciiva.com/8301/ds15002-8301350.pdf?src-supplier=Avnet; ComponentLink1Description: https://datasheet.ciiva.com/8301/ds15002-8301350.pdf?src-supplier=Avnet; ComponentLink2URL: https://datasheet.ciiva.com/8301/ds15002-8301721.pdf?src-supplier=Avnet; ComponentLink2Description: https://datasheet.ciiva.com/8301/ds15002-8301721.pdf?src-supplier=Avnet; ComponentLink3URL: https://datasheet.ciiva.com/26818/getdatasheetpartid-91887-26818092.pdf?src-supplier=Verical; ComponentLink3Description: https://datasheet.ciiva.com/26818/getdatasheetpartid-91887-26818092.pdf?src-supplier=Verical; ComponentLink4URL: https://datasheet.ciiva.com/25946/ds15002-25946239.pdf?src-supplier=Avnet+Europe; ComponentLink4Description: https://datasheet.ciiva.com/25946/ds15002-25946239.pdf?src-supplier=Avnet+Europe; Supplier Part Number 1: RS1MB-FDICT-ND
HL1-HL4 = SMLLXT0805GWTR: GLOVE, POLYAMIDE, L/FREE, PU, SIZE 6 - More Details; Manufacturer 1: Lumex; Color: Green; Lens Color: White; Lens Style: Rectangular,Diffused,Colorless; Luminous Intensity: 11mcd; Forward Voltage: 2V; Wavelength: 565nm; Forward Current: 20mA; Dominant Wavelength: 568nm; Number of LEDs: 1; Viewing Angle: 140°; Power Rating: 50mW; Lens Transparency: Diffused; Approvals: UL,CSA; Supplier 1: Newark; Manufacturer Part Number 1: SMLLXT0805GWTR; Stock 1: 0; RoHS: Yes; Mount: Surface Mount; Case/Package: 0805; Number of Pins: 2; Case Code (Metric): 2012; Case Code (Imperial): 0805; Min Operating Temperature: -25°C; Max Operating Temperature: 85°C; Package Quantity: 1; Packaging: Tape and Reel; Illumination Color: Green; Test Current: 20mA; Length: 2mm; Height: 0.8mm; Width: 1.25mm; Lead Free: Lead Free; REACH SVHC: No SVHC; ComponentLink1URL: https://datasheet.ciiva.com/2110/sml-lxt0805gw-tr-2110192.pdf?src-supplier=Digi-Key; ComponentLink1Description: https://datasheet.ciiva.com/2110/sml-lxt0805gw-tr-2110192.pdf?src-supplier=Digi-Key; ComponentLink2URL: https://datasheet.ciiva.com/4689/sml-lxt0805gw-tr-82662-4689266.pdf?src-supplier=Mouser; ComponentLink2Description: https://datasheet.ciiva.com/4689/sml-lxt0805gw-tr-82662-4689266.pdf?src-supplier=Mouser; ComponentLink3URL: https://datasheet.ciiva.com/30063/sml-lxt0805gw-tr-30063898.pdf?src-supplier=Onlinecomponents.com; ComponentLink3Description: https://datasheet.ciiva.com/30063/sml-lxt0805gw-tr-30063898.pdf?src-supplier=Onlinecomponents.com; ComponentLink4URL: https://datasheet.ciiva.com/2110/sml-lxt0805gw-tr-2110193.pdf?src-supplier=Digi-Key; ComponentLink4Description: https://datasheet.ciiva.com/2110/sml-lxt0805gw-tr-2110193.pdf?src-supplier=Digi-Key; ComponentLink5URL: https://datasheet.ciiva.com/2110/sml-lxt0805gw-tr-2110194.pdf?src-supplier=Digi-Key; ComponentLink5Description: https://datasheet.ciiva.com/2110/sml-lxt0805gw-tr-2110194.pdf?src-supplier=Digi-Key; ComponentLink6URL: https://datasheet.ciiva.com/16383/sml-lxt0805gw-tr-16383723.pdf?src-supplier=Future+Electronics; ComponentLink6Description: https://datasheet.ciiva.com/16383/sml-lxt0805gw-tr-16383723.pdf?src-supplier=Future+Electronics; Supplier Part Number 1: 58K2293
R21-R26 = RC0805JR-0710KL: as R1 on sheet [1] - MCU-CORE; Supplier 1: Digi-Key; Manufacturer Part Number 1: RC0805JR-0710KL; Pricing 1: 1=0.10000, 10=0.03600, 100=0.01460, 1000=0.00654, 2500=0.00568 (USD); Case/Package: 0805; Contact Plating: Tin,Matte; Case Code (Metric): 2012; Min Operating Temperature: -55°C; Max Operating Temperature: 155°C; Composition: Thick Film; Tolerance: 5%; Packaging: Tape and Reel; Termination: SMD/SMT; Military Standard: Not; Length: 2mm; Height: 0.5mm; Width: 1.25mm; Depth: 1.25mm; Radiation Hardening: No; REACH SVHC: Unknown; Lead Free: Lead Free; ComponentLink1URL: https://datasheet.ciiva.com/7983/444164-7983765.pdf?src-supplier=Element14; ComponentLink1Description: https://datasheet.ciiva.com/7983/444164-7983765.pdf?src-supplier=Element14; ComponentLink2URL: https://datasheet.ciiva.com/7941/444164-7941870.pdf?src-supplier=Element14; ComponentLink2Description: https://datasheet.ciiva.com/7941/444164-7941870.pdf?src-supplier=Element14; ComponentLink3URL: https://datasheet.ciiva.com/7941/444164-7941871.pdf?src-supplier=Element14; ComponentLink3Description: https://datasheet.ciiva.com/7941/444164-7941871.pdf?src-supplier=Element14; Supplier Part Number 1: 311-10KARCT-ND; Stock 1: 13413905; RoHS: Yes
R27-R30 = RC0805JR-071KL: RES SMD 1K OHM 5% 1/8W 0805; Manufacturer 1: Yageo; Temperature Coefficient: 100ppm/°C; Power Rating: 125mW; Voltage Rating: 150V; Supplier 1: Digi-Key; Manufacturer Part Number 1: RC0805JR-071KL; Stock 1: 6592717; Pricing 1: 1=0.10000, 10=0.03600, 100=0.01460, 1000=0.00654, 2500=0.00568 (USD); RoHS: Yes; Case/Package: 0805; Contact Plating: Tin,Lead,Matte; Case Code (Metric): 2012; Min Operating Temperature: -55°C; Max Operating Temperature: 155°C; Tolerance: 5%; Composition: Thick Film; Packaging: Tape and Reel; Termination: SMD/SMT; Military Standard: Not; Length: 2mm; Depth: 1.25mm; Radiation Hardening: No; REACH SVHC: Unknown; Lead Free: Lead Free; ComponentLink1URL: https://datasheet.ciiva.com/15190/getdatasheetpartid-135056-15190037.pdf?src-supplier=Verical; ComponentLink1Description: https://datasheet.ciiva.com/15190/getdatasheetpartid-135056-15190037.pdf?src-supplier=Verical; ComponentLink2URL: https://datasheet.ciiva.com/12667/rc0805-12667110.pdf?src-supplier=Mouser; ComponentLink2Description: https://datasheet.ciiva.com/12667/rc0805-12667110.pdf?src-supplier=Mouser; ComponentLink3URL: https://datasheet.ciiva.com/7941/442941-7941911.pdf?src-supplier=Element14; ComponentLink3Description: https://datasheet.ciiva.com/7941/442941-7941911.pdf?src-supplier=Element14; ComponentLink4URL: https://datasheet.ciiva.com/7941/442941-7941912.pdf?src-supplier=Element14; ComponentLink4Description: https://datasheet.ciiva.com/7941/442941-7941912.pdf?src-supplier=Element14; ComponentLink5URL: https://datasheet.ciiva.com/46395/444164-46395131.pdf?src-supplier=Element14; ComponentLink5Description: https://datasheet.ciiva.com/46395/444164-46395131.pdf?src-supplier=Element14; Supplier Part Number 1: 311-1.0KARCT-ND
U2 = L298P: IC BRIDGE DRIVER PAR 20POWERSO; Manufacturer 1: STMicroelectronics; Operating Supply Voltage: 42V; Min Supply Voltage: 4.8V; Max Supply Voltage: 46V; Output Current: 2A; Number of Outputs: 4; Operating Supply Current: 13mA; Max Collector Current: 3A; Number of Channels: 2; Motor Type: Brushed; Supplier 1: Digi-Key; Manufacturer Part Number 1: L298P; Stock 1: 1834; Pricing 1: 1=5.96000, 10=5.38400, 100=4.45710, 500=3.88120, 1000=3.38040 (USD); RoHS: Yes; Mount: Surface Mount; Case/Package: SOIC; Number of Pins: 20; Min Operating Temperature: -25°C; Max Operating Temperature: 130°C; Packaging: Rail/Tube; Package Quantity: 31; Collector Emitter Voltage (VCEO): 46V; Max Output Current: 3A; Output Current per Channel: 2A; Length: 16mm; Height: 3.3mm; Width: 11.1mm; Radiation Hardening: No; Lead Free: Lead Free; ComponentLink1URL: https://datasheet.ciiva.com/19456/1389265-19456706.pdf?src-supplier=Jameco; ComponentLink1Description: https://datasheet.ciiva.com/19456/1389265-19456706.pdf?src-supplier=Jameco; ComponentLink2URL: https://datasheet.ciiva.com/4895/cd00000240-224711-4895923.pdf?src-supplier=Mouser; ComponentLink2Description: https://datasheet.ciiva.com/4895/cd00000240-224711-4895923.pdf?src-supplier=Mouser; ComponentLink3URL: https://datasheet.ciiva.com/15109/getdatasheetpartid-162293-15109403.pdf?src-supplier=Verical; ComponentLink3Description: https://datasheet.ciiva.com/15109/getdatasheetpartid-162293-15109403.pdf?src-supplier=Verical; ComponentLink4URL: https://datasheet.ciiva.com/26880/l298p-26880155.pdf?src-supplier=IIIC; ComponentLink4Description: https://datasheet.ciiva.com/26880/l298p-26880155.pdf?src-supplier=IIIC; ComponentLink5URL: https://datasheet.ciiva.com/1957/cd00000240-1957024.pdf?src-supplier=Digi-Key; ComponentLink5Description: https://datasheet.ciiva.com/1957/cd00000240-1957024.pdf?src-supplier=Digi-Key; Supplier Part Number 1: 497-1396-5-ND